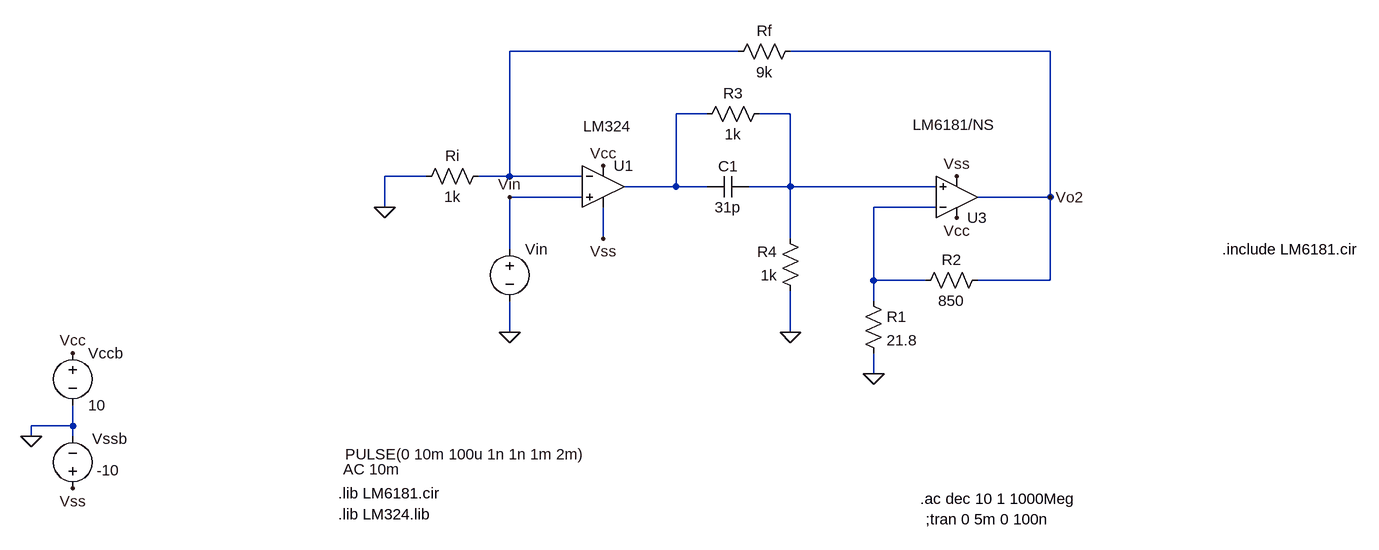
[diagram p0: schematic Lab3_Compensacion(VFA-CFA) (2).asc]
Lab3_Compensacion(VFA-CFA) (2).asc, the LTspice schematic file:
Version 4
SHEET 1 1340 712
WIRE 368 -64 16 -64
WIRE 848 -64 448 -64
WIRE 320 32 272 32
WIRE 448 32 400 32
WIRE -112 128 -176 128
WIRE 16 128 16 -64
WIRE 16 128 -32 128
WIRE 128 128 16 128
WIRE 272 144 272 32
WIRE 272 144 192 144
WIRE 320 144 272 144
WIRE 448 144 448 32
WIRE 448 144 384 144
WIRE 672 144 448 144
WIRE 128 160 16 160
WIRE 848 160 848 -64
WIRE 848 160 736 160
WIRE -176 176 -176 128
WIRE 672 176 576 176
WIRE 160 224 160 176
WIRE 448 224 448 144
WIRE 16 240 16 160
WIRE 576 288 576 176
WIRE 656 288 576 288
WIRE 848 288 848 160
WIRE 848 288 736 288
WIRE 576 320 576 288
WIRE 16 368 16 320
WIRE 448 368 448 304
WIRE 576 432 576 400
WIRE -656 512 -656 480
WIRE -656 512 -720 512
WIRE -720 528 -720 512
WIRE -656 528 -656 512
FLAG 160 224 Vss
FLAG 160 112 Vcc
FLAG 16 368 0
FLAG -720 528 0
FLAG -656 400 Vcc
FLAG -656 608 Vss
FLAG -176 176 0
FLAG 576 432 0
FLAG 704 192 Vcc
FLAG 704 128 Vss
FLAG 848 160 Vo2
FLAG 448 368 0
FLAG 16 160 Vin
SYMBOL OpAmps\\opamp2 160 80 R0
WINDOW 3 -31 -29 Left 2
SYMATTR InstName U1
SYMATTR Value LM324
SYMBOL voltage 16 224 R0
WINDOW 123 -256 355 Left 2
WINDOW 39 0 0 Left 0
WINDOW 3 -253 332 Left 2
SYMATTR Value2 AC 10m
SYMATTR Value PULSE(0 10m 100u 1n 1n 1m 2m)
SYMATTR InstName Vin
SYMBOL voltage -656 384 R0
WINDOW 123 0 0 Left 0
WINDOW 39 0 0 Left 0
SYMATTR InstName Vccb
SYMATTR Value 10
SYMBOL voltage -656 624 R180
WINDOW 123 0 0 Left 0
WINDOW 39 0 0 Left 0
WINDOW 0 -83 92 Left 2
WINDOW 3 -72 44 Left 2
SYMATTR InstName Vssb
SYMATTR Value -10
SYMBOL res 560 304 R0
SYMATTR InstName R1
SYMATTR Value 21.8
SYMBOL res 752 272 R90
WINDOW 0 0 56 VBottom 2
WINDOW 3 32 56 VTop 2
SYMATTR InstName R2
SYMATTR Value 850
SYMBOL res 464 -80 R90
WINDOW 0 0 56 VBottom 2
WINDOW 3 32 56 VTop 2
SYMATTR InstName Rf
SYMATTR Value 9k
SYMBOL res -16 112 R90
WINDOW 0 0 56 VBottom 2
WINDOW 3 32 56 VTop 2
SYMATTR InstName Ri
SYMATTR Value 1k
SYMBOL OpAmps\\opamp2 704 224 M180
WINDOW 3 -68 175 Left 2
SYMATTR InstName U3
SYMATTR Value LM6181/NS
SYMBOL res 416 16 R90
WINDOW 0 0 56 VBottom 2
WINDOW 3 32 56 VTop 2
SYMATTR InstName R3
SYMATTR Value 1k
SYMBOL res 464 320 R180
WINDOW 0 36 76 Left 2
WINDOW 3 36 40 Left 2
SYMATTR InstName R4
SYMATTR Value 1k
SYMBOL cap 384 128 R90
WINDOW 0 0 32 VBottom 2
WINDOW 3 32 32 VTop 2
SYMATTR InstName C1
SYMATTR Value 31p
TEXT -248 648 Left 2 !.lib LM324.lib
TEXT 648 624 Left 2 !.ac dec 10 1 1000Meg
TEXT 656 656 Left 2 !;tran 0 5m 0 100n
TEXT -248 616 Left 2 !.lib LM6181.cir
TEXT 1112 240 Left 2 !.include LM6181.cir

The netlist it stands for:
* Lab3_Compensacion(VFA-CFA) (2).asc
XU1 Vin N001 Vcc Vss N002 LM324  ; pins In+ In- V+ V- OUT
Vin Vin 0 PULSE(0 10m 100u 1n 1n 1m 2m) AC 10m
Vccb Vcc 0 10
Vssb Vss 0 -10
R1 N004 0 21.8
R2 Vo2 N004 850
Rf Vo2 N001 9k
Ri N001 0 1k
XU3 N003 N004 Vcc Vss Vo2 LM6181/NS  ; pins In+ In- V+ V- OUT
R3 N003 N002 1k
R4 0 N003 1k
C1 N003 N002 31p
.lib LM324.lib
.ac dec 10 1 1000Meg
;tran 0 5m 0 100n
.lib LM6181.cir
.include LM6181.cir
.backanno
.end